# Altium schematic sheet TIDA-PowerNBIoT_Boost.SchDoc
size 431 x 279 mm; Date: Not shown in title block; ApprovedBy: Not shown in title block; CheckedBy: Not shown in title block; Author: Not shown in title block; CompanyName: Not shown in title block; Engineer: Not shown in title block; Organization: Not shown in title block; Address1: Not shown in title block; Address2: Not shown in title block; Address3: Not shown in title block; Address4: Not shown in title block; DocumentNumber: 1; Revision: Use project parameter SCH_Rev; SheetNumber: 2; SheetTotal: 3; PageSetup: Record=PageOptions|CenterHorizontal=True|CenterVertical=True|PrintScale=1.00|XCorrection=1.00|YCorrection=1.00|PrintKind=0|BorderSize=5000000|LeftOffset=0|BottomOffset=0|Orientation=2|PaperLength=1000|PaperWidth=1000|Scale=100|PaperSource=15|PrintQuality=600|MediaType=1|DitherType=10|PaperKind=Letter|PrintScaleMode=1; CurrentTime: Not shown in title block; CurrentDate: Not shown in title block; Time: Not shown in title block; DocumentFullPathAndName: Not shown in title block; DocumentName: Not shown in title block; ModifiedDate: Not shown in title block; ImagePath: Not shown in title block
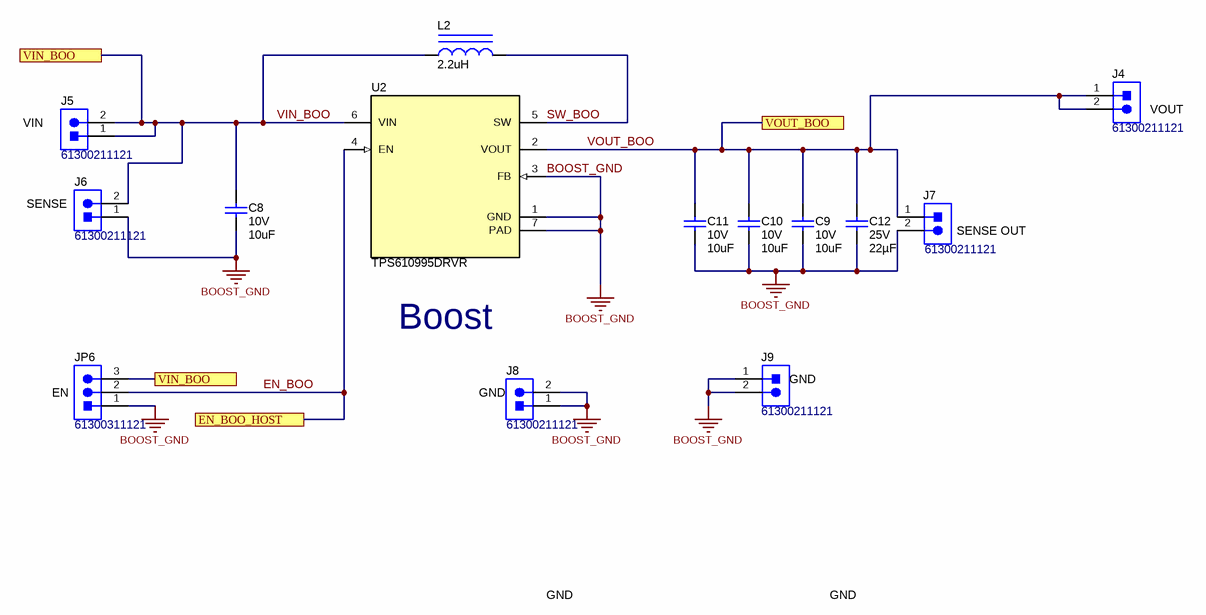
[diagram p0: TIDA-PowerNBIoT_Boost.SchDoc]

## Parts
C8  VDC_V: 10V  ValueDisplayed: 10uF  [0603]  (hidden comment: GRM188Z71A106MA73D)
C9  VDC_V: 10V  ValueDisplayed: 10uF  [0603]  (hidden comment: GRM188Z71A106MA73D)
C10  VDC_V: 10V  ValueDisplayed: 10uF  [0603]  (hidden comment: GRM188Z71A106MA73D)
C11  VDC_V: 10V  ValueDisplayed: 10uF  [0603]  (hidden comment: GRM188Z71A106MA73D)
C12  VDC_V: 25V  ValueDisplayed: 22µF  [0805_HV]  (hidden comment: TMK212B7225KG-TR)
J4  61300211121  [WURTH_61300211121]
J5  61300211121  [WURTH_61300211121]
J6  61300211121  [WURTH_61300211121]
J7  61300211121  [WURTH_61300211121]
J8  61300211121  [WURTH_61300211121]
J9  61300211121  [WURTH_61300211121]
JP6  61300311121  [WURTH_61300311121]
L2  ValueDisplayed: 2.2uH  [WE_LQS_252012]  (hidden comment: 74404024022)
U2  TPS610995DRVR  [DRV0006A]

## Ports
EN_BOO_HOST, VIN_BOO, VOUT_BOO

## Nets
BOOST_GND: C8.2 C9.2 C10.2 C11.2 C12.2 J6.1 J7.2 J8.1 J8.2 J9.1 J9.2 JP6.1 U2.1(GND) U2.3(FB) U2.7(PAD)
EN_BOO: JP6.2 U2.4(EN) ; port EN_BOO_HOST
SW_BOO: L2.2 U2.5(SW)
VIN_BOO: C8.1 J5.1 J5.2 J6.2 JP6.3 L2.1 U2.6(VIN) ; port VIN_BOO
VOUT_BOO: C9.1 C10.1 C11.1 C12.1 J4.1 J4.2 J7.1 U2.2(VOUT) ; port VOUT_BOO

## Notes on the sheet
- (near J5) VIN
- (near J4) VOUT
- (near J6) SENSE
- (near J7) SENSE OUT
- (near JP6) EN
- Boost
- (near J8) GND
- (near J9) GND
- GND
- Drawn By:
- SVN Rev:
- Number:
- TID #:
- Orderable:
- Rev:
- Sheet Title:
- File:
- Project Title:
- Designed for:
- Assembly Variant:
- Mod. Date:
- Sheet:
- Size:
- of
- B
- http://www.ti.com
- Texas Instruments and/or its licensors do not warrant the accuracy or completeness of this specification or any information contained therein. Texas Instruments and/or its licensors do not warrant that this design will meet the specifications, will be suitable for your application or fit for any particular purpose, or will operate in an implementation. Texas Instruments and/or its licensors do not warrant that the design is production worthy. You should completely validate and test your design implementation to confirm the system functionality for your application.
- Engineer:
- Contact:
- © Texas Instruments

## Library data of the parts
C8-C11 = CMP-0007497-5: CAP, CERM, 10 uF, 10 V, +/- 20%, X7R, 0603; Manufacturer: MuRata; TaMin_C: -55°C; Polarized: N; SizeAreaWB_mm2: 4.68; Value1: Unknown; U/M: EA; Value: 10uF; TaMax_C: 125°C; SizeZ_mm: 1; SizeX_mm: 1.6; SizeY_mm: 0.8; SizeArea_mm2: 1.28; CompType: Capacitor; Cap_F: 10µF; AEC Category: Q200; Publisher: Texas Instruments; TempCo: X7R; Published: 2008-06-19; RoHS: Y; MountType: SMT; Supplier 1: Mouser; PackageReference: 0603; Tolerance_%: 20%; Cap_Case: 0603; Value2: 10V; LatestRevisionDate: 2017-03-09; PartNumber: GRM188Z71A106MA73D; AEC Qualified: N; ComponentLink1Description: Datasheet link; AEC Grade: N/A; Supplier Part Number 1: 81-GRM188Z71A106MA3D; Technology: Ceramic; ComponentLink1URL: http://psearch.en.murata.com/capacitor/product/GRM188Z71A106MA73%23.pdf
C12 = CMP-0080705-1: CAP, CERM, 22 µF, 25 V,+/- 10%, X7R, 0805; Manufacturer: Taiyo Yuden; SizeAreaWB_mm2: 6.75; SizeArea_mm2: 2.5; AEC Qualified: N; AEC Category: Q200; Value: 22uF; TaMax_C: 125°C; SizeZ_mm: 1.45; TaMin_C: -55°C; SizeY_mm: 1.25; U/M: EA; CompType: Capacitor; SizeX_mm: 2; Cap_Case: 0805; ComponentLink1Description: Datasheet link; Cap_F: 22µF; RoHS: Y; Supplier Part Number 3: 963-TMK212B7225KG-TR; Tolerance_%: 10%; Supplier 1: Digi-Key; PackageReference: 0805; Technology: Ceramic; PartNumber: TMK212B7225KG-TR; TempCo: X7R; Supplier Part Number 2: 92T9715; Supplier 2: Newark; AEC Grade: N/A; Polarized: N; Value2: 25V; ComponentLink1URL: https://www.yuden.co.jp/productdata/catalog/mlcc_all_e.pdf; MountType: SMT; Supplier Part Number 1: 587-2991-1-ND; Supplier 3: Mouser
J4-J9 = CMP-0054794-2: Header, 2.54 mm, 2x1, Gold, TH; Manufacturer: Wurth Elektronik; Shrouded: N; Gender: Male; Green_REACh: Passed; Pitch_mm: 2.54; Green_Lifecycle: Active; Row_Count: 1; Cert_UL: Y; Supplier Part Number 2: 20X0948; Orientation: Vertical; PinCount: 2; ClassName: Header; Supplier 2: Newark; PackageReference: Header, 2.54mm, 2x1, TH; CompType: Header; ComponentLink1Description: Datasheet URL; Supplier 1: Digi-Key; Green_EU RoHS-2: Incomplete; ComponentLink1URL: http://katalog.we-online.de/em/datasheet/6130xx11121.pdf; Green_EU RoHS: Passed; MountType: TH; Supplier Part Number 3: 710-61300211121; RoHS: Y; Supplier Part Number 1: 732-5315-ND; ContactFinish: Gold; Supplier 3: Mouser; PartNumber: 61300211121; Color: Black
JP6 = CMP-0054796-2: Header, 2.54 mm, 3x1, Gold, TH; Manufacturer: Wurth Elektronik; Pitch_mm: 2.54; Green_Lifecycle: Active; Cert_UL: Y; Shrouded: N; Green_REACh: Passed; Gender: Male; Row_Count: 1; MountType: TH; Supplier Part Number 1: 732-5316-ND; PinCount: 3; Color: Black; ClassName: Header; Supplier Part Number 3: 356154; ContactFinish: Gold; ComponentLink1Description: Datasheet URL; ComponentLink1URL: http://katalog.we-online.de/em/datasheet/6130xx11121.pdf; PackageReference: Header, 2.54mm, 3x1, TH; Supplier Part Number 2: 20X0950; Green_EU RoHS-2: Incomplete; CompType: Header; Green_EU RoHS: Passed; Orientation: Vertical; RoHS: Y; PartNumber: 61300311121; Supplier 2: Newark; Supplier 1: Digi-Key; Supplier 3: Farnell
L2 = CMP-0063791-1: Inductor, Wirewound, Ferrite, 2.2 uH, 1.8 A, 0.08 ohm, SMD; Manufacturer: Wurth Elektronik; Isat: 1.95A @ 30% inductance drop; Irms: 1.8A @ 40C rise; Green_Lifecycle: Active; SizeAreaWB_mm2: 10.5; DCR_ohm: 0.08; Green_REACh: Passed; Value: 2.2uH; Imax_A: 1.8A; SizeZ_mm: 1.2; SizeX_mm: 2.5; SizeY_mm: 2; SizeArea_mm2: 5; Ind_H: 2.2µH; AEC Qualified: N; AEC Category: Q200; ComponentLink1URL: http://katalog.we-online.de/pbs/datasheet/74404024022.pdf; Supplier Part Number 2: 75X1095; Publisher: Texas Instruments; Supplier 2: Newark; Supplier Part Number 3: 710-74404024022; Supplier 3: Mouser; Published: 2008-06-26; RoHS: Y; Value1: 0.08 ohm; Material: Ferrite; MountType: SMT; Green_EU RoHS-2: Incomplete; Supplier 1: Digi-Key; Green_EU RoHS: Passed; PackageReference: SMD, 2.5x2mm; Value2: 1.8A; CompType: Inductor; LatestRevisionDate: 2017-06-02; PartNumber: 74404024022; ComponentLink1Description: Datasheet link; AEC Grade: N/A; Supplier Part Number 1: 732-5436-1-ND; Technology: Wirewound
U2 = CMP-0079929-1: Synchronous Boost Converter with 800 nA Ultra-Low Quiescent Current, DRV0006A (WSON-6); Alternate PartNumber: TPS610995DRVT; Alternate Manufacturer: Texas Instruments; SizeAreaWB_mm2: 9; SizeZ_mm: 0.8; SizeX_mm: 2; SizeArea_mm2: 4; CompType: IC; AEC Qualified: N; AEC Category: Q200; ComponentLink1URL: http://www.ti.com/lit/ds/symlink/tps61099.pdf; PackageDescription: WSON-6; MountType: SMT; ComponentLink2URL: http://www.ti.com/product/tps61099; ComponentLink3Description: Online Datasheet; ComponentLink2Description: Product Folder; Manufacturer: Texas Instruments; ComponentLink3URL: http://www.ti.com/product/tps61099/datasheet; PackageReference: DRV0006A; SizeY_mm: 2; PartNumber: TPS610995DRVR; ComponentLink1Description: Datasheet Link